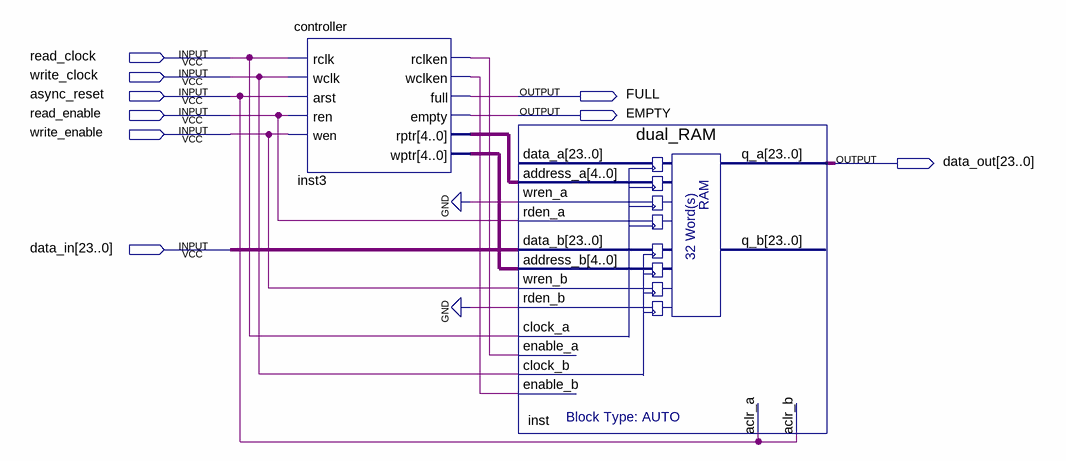
[diagram p0: schematic sheet]
// Quartus schematic fFFf.bdf as structural Verilog: 2 symbols, 9 pins
module fFFf (
  input  read_clock,
  input  write_clock,
  input  async_reset,
  input  read_enable,
  input  write_enable,
  input  [23:0] data_in,
  output FULL,
  output EMPTY,
  output [23:0] data_out
);

  wire inst3_rclken, inst3_wclken;
  wire [4:0] inst3_rptr, inst3_wptr;

  controller inst3 (
    .rclk(read_clock), .wclk(write_clock), .arst(async_reset), .ren(read_enable), .wen(write_enable),
    .rclken(inst3_rclken), .wclken(inst3_wclken), .full(FULL), .empty(EMPTY), .rptr(inst3_rptr),
    .wptr(inst3_wptr));
  dual_RAM inst (
    .address_a(inst3_rptr), .wren_a(1'b0), .rden_a(read_enable), .data_b(data_in), .address_b(inst3_wptr),
    .wren_b(write_enable), .rden_b(1'b0), .clock_a(read_clock), .enable_a(inst3_rclken),
    .clock_b(write_clock), .enable_b(inst3_wclken), .aclr_a(async_reset), .aclr_b(async_reset), .q_a(data_out));  // open: data_a, q_b
endmodule
